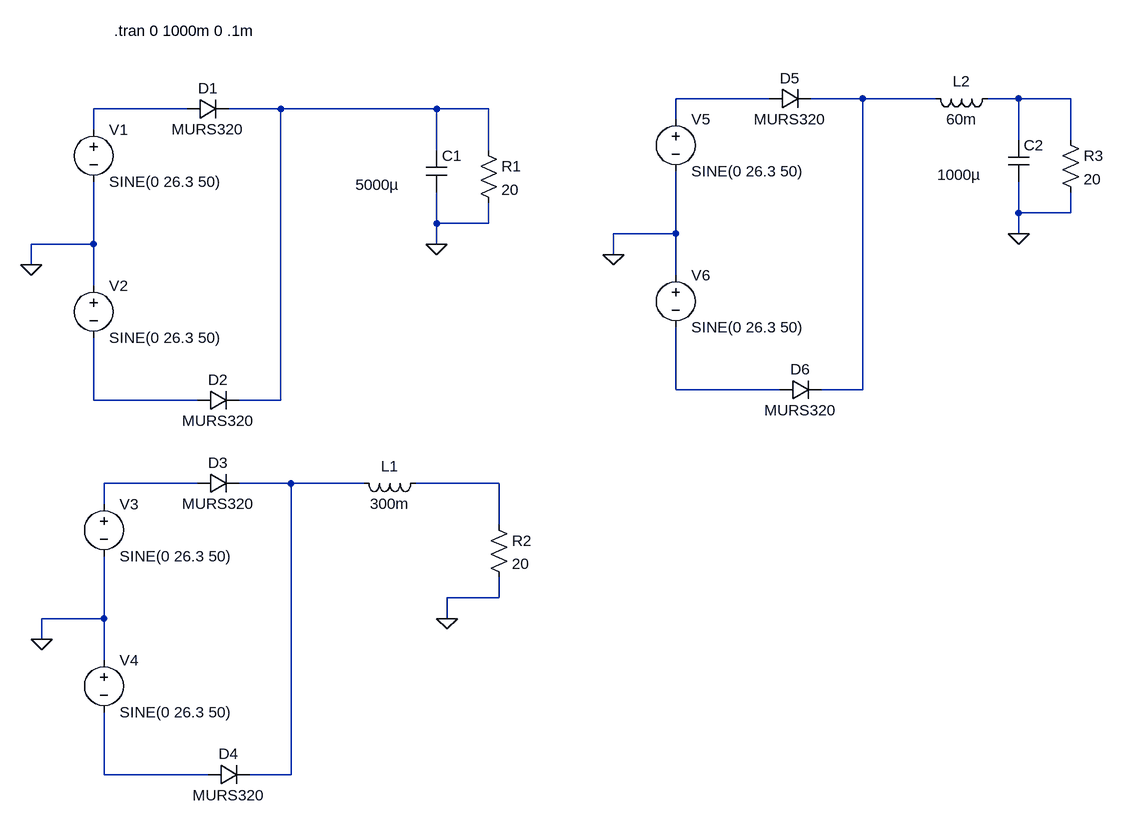
[diagram p0: schematic rectificador_ondacompleta.asc]
rectificador_ondacompleta.asc, the LTspice schematic file:
Version 4
SHEET 1 1624 1152
WIRE 1104 64 960 64
WIRE 1248 64 1168 64
WIRE 1360 64 1248 64
WIRE 1488 64 1440 64
WIRE 1568 64 1488 64
WIRE 208 80 64 80
WIRE 352 80 272 80
WIRE 592 80 352 80
WIRE 672 80 592 80
WIRE 960 96 960 64
WIRE 64 112 64 80
WIRE 1488 128 1488 64
WIRE 1568 128 1568 64
WIRE 592 144 592 80
WIRE 672 144 672 80
WIRE 1488 240 1488 192
WIRE 1568 240 1568 208
WIRE 1568 240 1488 240
WIRE 592 256 592 208
WIRE 672 256 672 224
WIRE 672 256 592 256
WIRE 960 272 960 176
WIRE 960 272 864 272
WIRE 1488 272 1488 240
WIRE 64 288 64 192
WIRE 64 288 -32 288
WIRE 592 288 592 256
WIRE 864 304 864 272
WIRE -32 320 -32 288
WIRE 960 336 960 272
WIRE 64 352 64 288
WIRE 960 512 960 416
WIRE 1120 512 960 512
WIRE 1248 512 1248 64
WIRE 1248 512 1184 512
WIRE 64 528 64 432
WIRE 224 528 64 528
WIRE 352 528 352 80
WIRE 352 528 288 528
WIRE 224 656 80 656
WIRE 368 656 288 656
WIRE 480 656 368 656
WIRE 688 656 560 656
WIRE 80 688 80 656
WIRE 688 720 688 656
WIRE 688 832 688 800
WIRE 688 832 608 832
WIRE 80 864 80 768
WIRE 80 864 -16 864
WIRE 608 864 608 832
WIRE -16 896 -16 864
WIRE 80 928 80 864
WIRE 80 1104 80 1008
WIRE 240 1104 80 1104
WIRE 368 1104 368 656
WIRE 368 1104 304 1104
FLAG 592 288 0
FLAG -32 320 0
FLAG 608 864 0
FLAG -16 896 0
FLAG 1488 272 0
FLAG 864 304 0
SYMBOL voltage 64 96 R0
WINDOW 123 0 0 Left 2
WINDOW 39 0 0 Left 2
SYMATTR InstName V1
SYMATTR Value SINE(0 26.3 50)
SYMBOL cap 576 144 R0
WINDOW 3 -109 53 Left 2
SYMATTR Value 5000µ
SYMATTR InstName C1
SYMBOL res 656 128 R0
SYMATTR InstName R1
SYMATTR Value 20
SYMBOL diode 208 96 R270
WINDOW 0 32 32 VTop 2
WINDOW 3 0 32 VBottom 2
SYMATTR InstName D1
SYMATTR Value MURS320
SYMBOL voltage 64 336 R0
WINDOW 123 0 0 Left 2
WINDOW 39 0 0 Left 2
SYMATTR InstName V2
SYMATTR Value SINE(0 26.3 50)
SYMBOL diode 224 544 R270
WINDOW 0 32 32 VTop 2
WINDOW 3 0 32 VBottom 2
SYMATTR InstName D2
SYMATTR Value MURS320
SYMBOL voltage 80 672 R0
WINDOW 123 0 0 Left 2
WINDOW 39 0 0 Left 2
SYMATTR InstName V3
SYMATTR Value SINE(0 26.3 50)
SYMBOL res 672 704 R0
SYMATTR InstName R2
SYMATTR Value 20
SYMBOL diode 224 672 R270
WINDOW 0 32 32 VTop 2
WINDOW 3 0 32 VBottom 2
SYMATTR InstName D3
SYMATTR Value MURS320
SYMBOL voltage 80 912 R0
WINDOW 123 0 0 Left 2
WINDOW 39 0 0 Left 2
SYMATTR InstName V4
SYMATTR Value SINE(0 26.3 50)
SYMBOL diode 240 1120 R270
WINDOW 0 32 32 VTop 2
WINDOW 3 0 32 VBottom 2
SYMATTR InstName D4
SYMATTR Value MURS320
SYMBOL ind 576 640 R90
WINDOW 0 5 56 VBottom 2
WINDOW 3 32 56 VTop 2
SYMATTR InstName L1
SYMATTR Value 300m
SYMBOL voltage 960 80 R0
WINDOW 123 0 0 Left 2
WINDOW 39 0 0 Left 2
SYMATTR InstName V5
SYMATTR Value SINE(0 26.3 50)
SYMBOL res 1552 112 R0
SYMATTR InstName R3
SYMATTR Value 20
SYMBOL diode 1104 80 R270
WINDOW 0 32 32 VTop 2
WINDOW 3 0 32 VBottom 2
SYMATTR InstName D5
SYMATTR Value MURS320
SYMBOL voltage 960 320 R0
WINDOW 123 0 0 Left 2
WINDOW 39 0 0 Left 2
SYMATTR InstName V6
SYMATTR Value SINE(0 26.3 50)
SYMBOL diode 1120 528 R270
WINDOW 0 32 32 VTop 2
WINDOW 3 0 32 VBottom 2
SYMATTR InstName D6
SYMATTR Value MURS320
SYMBOL ind 1456 48 R90
WINDOW 0 5 56 VBottom 2
WINDOW 3 32 56 VTop 2
SYMATTR InstName L2
SYMATTR Value 60m
SYMBOL cap 1472 128 R0
WINDOW 3 -109 53 Left 2
SYMATTR Value 1000µ
SYMATTR InstName C2
TEXT 96 -40 Left 2 !.tran 0 1000m 0 .1m

The netlist it stands for:
* rectificador_ondacompleta.asc
V1 N004 0 SINE(0 26.3 50)
C1 N005 0 5000µ
R1 N005 0 20
D1 N004 N005 MURS320
V2 0 N007 SINE(0 26.3 50)
D2 N007 N005 MURS320
V3 N008 0 SINE(0 26.3 50)
R2 N010 0 20
D3 N008 N009 MURS320
V4 0 N011 SINE(0 26.3 50)
D4 N011 N009 MURS320
L1 N010 N009 300m
V5 N001 0 SINE(0 26.3 50)
R3 N003 0 20
D5 N001 N002 MURS320
V6 0 N006 SINE(0 26.3 50)
D6 N006 N002 MURS320
L2 N003 N002 60m
C2 N003 0 1000µ
.model D D
.lib standard.dio
.tran 0 1000m 0 .1m
.backanno
.end